# Altium schematic sheet SOW_2018_V1.SchDoc
size A1
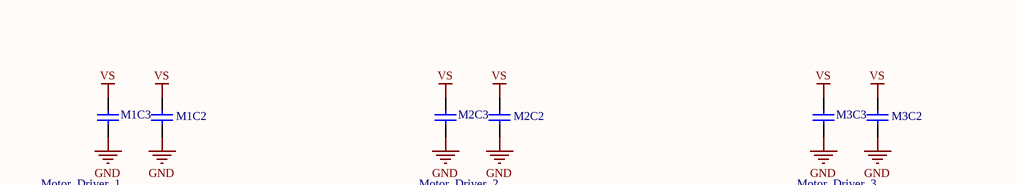
[diagram p0: SOW_2018_V1.SchDoc, top left]
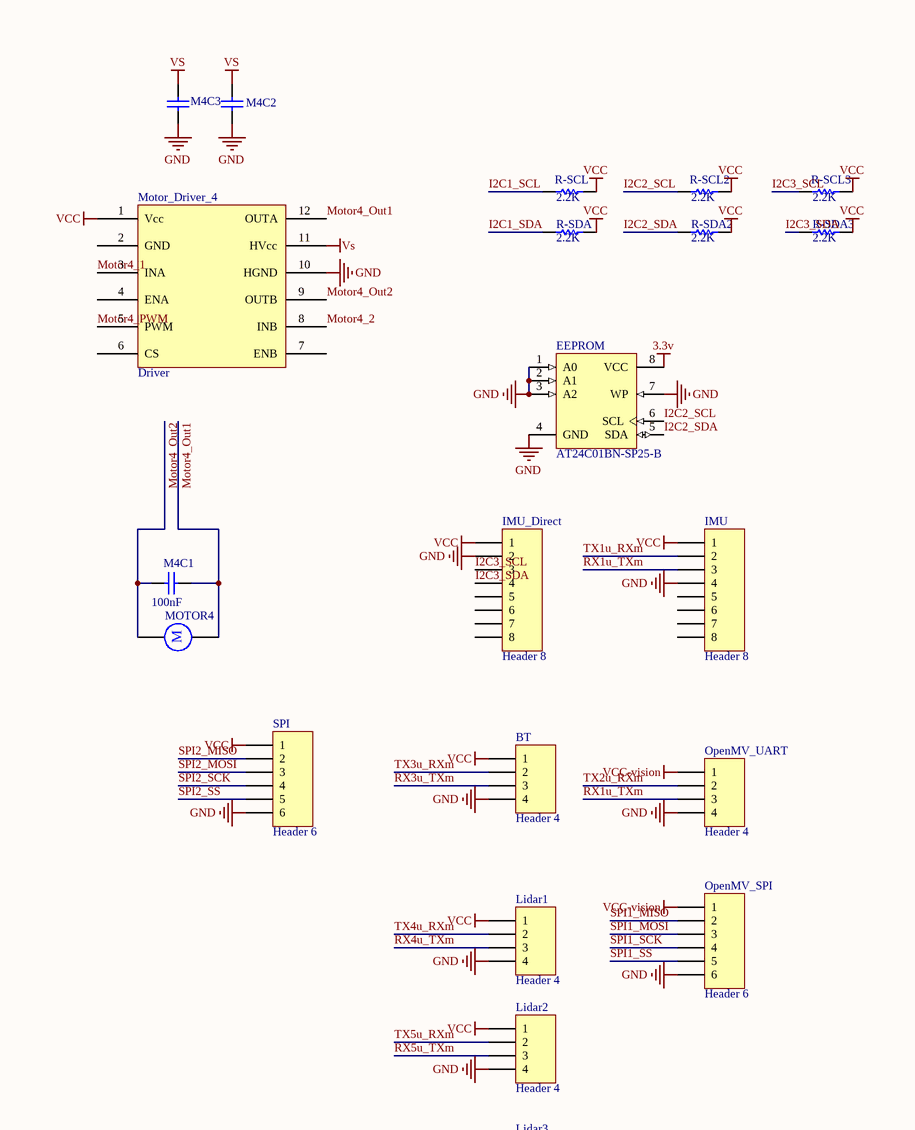
[diagram p1: SOW_2018_V1.SchDoc, top right]
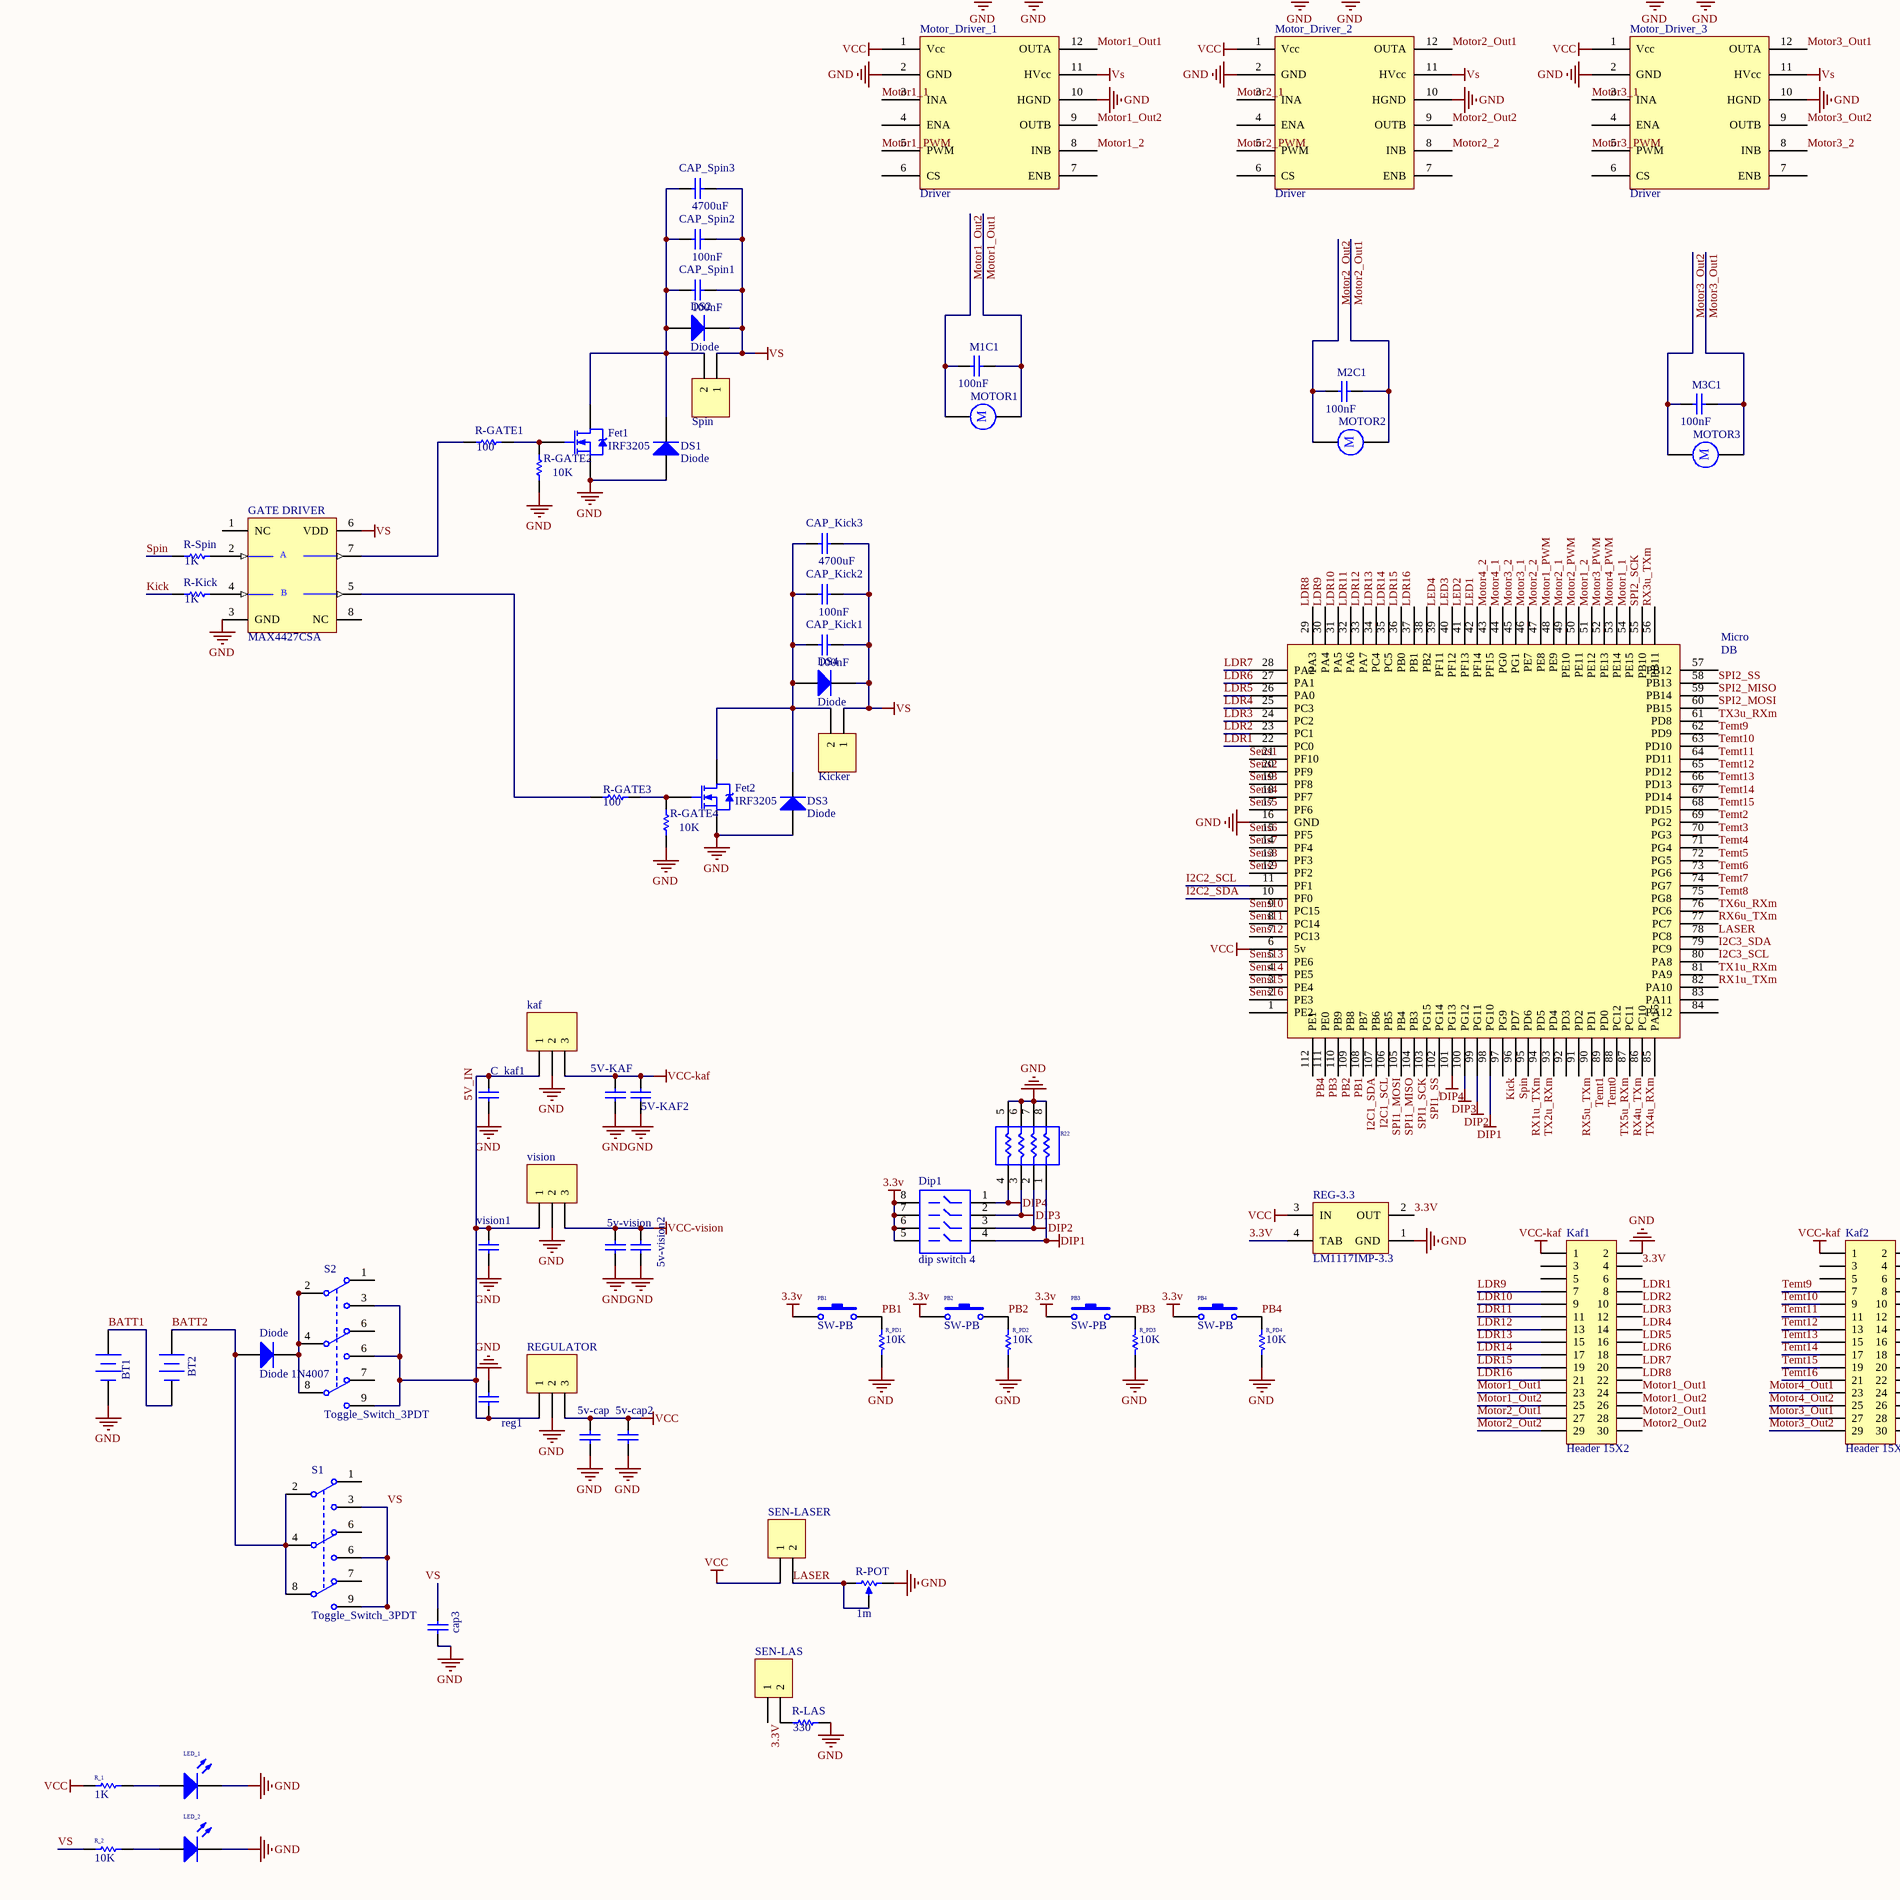
[diagram p2: SOW_2018_V1.SchDoc, bottom left]
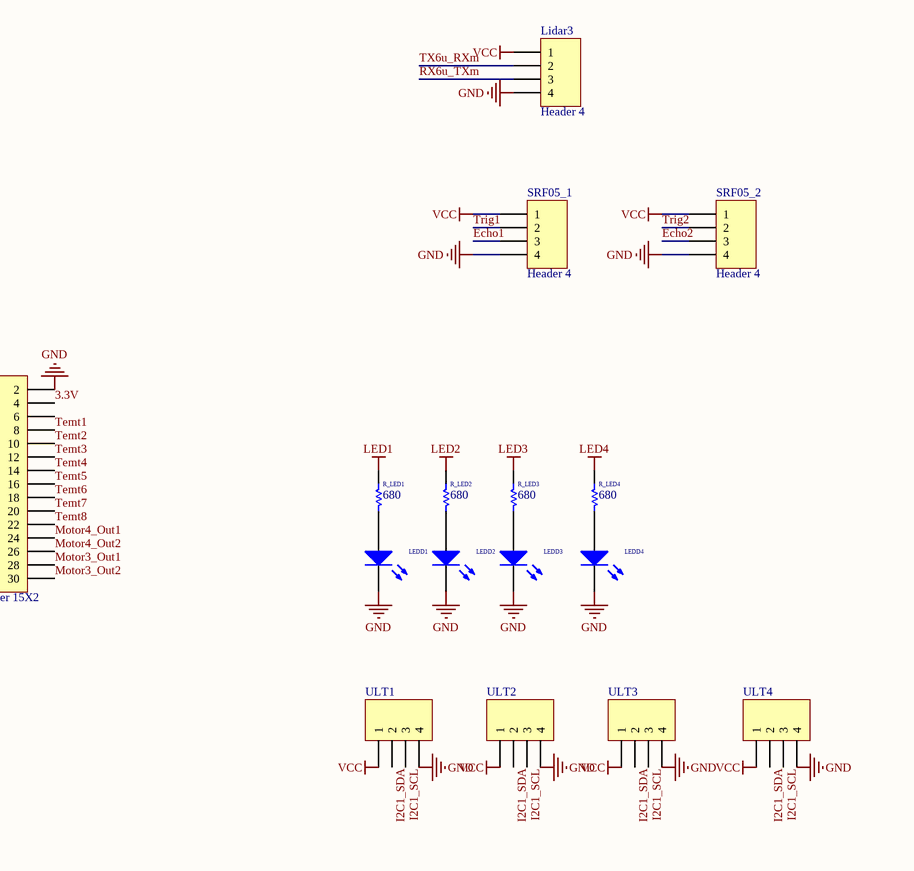
[diagram p3: SOW_2018_V1.SchDoc, bottom right]

## Parts
5v-cap  Cap  [c100_63v]  (value not drawn)
5v-cap2  Cap Semi  [805]  (value not drawn)
5V-KAF  Cap  [c100_63v]  (value not drawn)
5V-KAF2  Cap Semi  [805]  (value not drawn)
5v-vision  Cap  [c100_63v]  (value not drawn)
5v-vision2  Cap Semi  [805]  (value not drawn)
BT  Header 4  [Round4]
BT1  Battery  [XT60]  (value not drawn)
BT2  Battery  [XT60]  (value not drawn)
C_kaf1  Cap Semi  [805]  (value not drawn)
cap3  Cap  [C1000uf50v]  (value not drawn)
CAP_Kick1  100nf  [805]
CAP_Kick2  100nf  [805]
CAP_Kick3  4700uf  [805]
CAP_Spin1  100nf  [805]
CAP_Spin2  100nf  [805]
CAP_Spin3  4700uf  [805]
Diode  Diode 1N4007  [STTA806]
Dip1  dip switch 4  [DIPsw4]
DS1  Diode  [stta806]
DS2  Diode  [stta806]
DS3  Diode  [stta806]
DS4  Diode  [stta806]
EEPROM  AT24C01BN-SP25-B  [8S1_M]
Fet1  IRF3205  [TO220]
Fet2  IRF3205  [TO220]
GATE_DRIVER  MAX4427CSA  [SO-8]
IMU  Header 8  [Round8]
IMU_Direct  Header 8  [Round8]
kaf  Header 3  [LM2576]  (value not drawn)
Kaf1  Header 15X2  [PHL2X15]
Kaf2  Header 15X2  [PHL2X15]
Kicker  Header 2  [Phoenix_2pin]  (value not drawn)
LED_1  LED Green 0603  [805]  (value not drawn)
LED_2  LED Green 0805  [805]  (value not drawn)
LEDD1  LED Green 0603  [805]  (value not drawn)
LEDD2  LED Green 0603  [805]  (value not drawn)
LEDD3  LED Green 0603  [805]  (value not drawn)
LEDD4  LED Green 0603  [805]  (value not drawn)
Lidar1  Header 4  [Round4]
Lidar2  Header 4  [Round4]
Lidar3  Header 4  [Round4]
M1C1  value 100nF  [C0805]  (hidden comment: Cap Semi)
M1C2  Cap Semi  [C0805]  (value not drawn)
M1C3  Cap Semi  [C1000uf50v]  (value not drawn)
M2C1  value 100nF  [C0805]  (hidden comment: Cap Semi)
M2C2  Cap Semi  [C0805]  (value not drawn)
M2C3  Cap Semi  [C1000uf50v]  (value not drawn)
M3C1  value 100nF  [C0805]  (hidden comment: Cap Semi)
M3C2  Cap Semi  [C0805]  (value not drawn)
M3C3  Cap Semi  [C1000uf50v]  (value not drawn)
M4C1  value 100nF  [C0805]  (hidden comment: Cap Semi)
M4C2  Cap Semi  [C0805]  (value not drawn)
M4C3  Cap Semi  [C1000uf50v]  (value not drawn)
Micro  DB  [DBPCB]
MOTOR1  Motor  [Round2]  (value not drawn)
MOTOR2  Motor  [Round2]  (value not drawn)
MOTOR3  Motor  [Round2]  (value not drawn)
MOTOR4  Motor  [Round2]  (value not drawn)
Motor_Driver_1  Driver  [Driver]
Motor_Driver_2  Driver  [Driver]
Motor_Driver_3  Driver  [Driver]
Motor_Driver_4  Driver  [Driver]
OpenMV_SPI  Header 6  [Round6]
OpenMV_UART  Header 4  [Round4]
PB1  SW-PB  [TactSMD]
PB2  SW-PB  [TactSMD]
PB3  SW-PB  [TactSMD]
PB4  SW-PB  [TactSMD]
R22  10K  [Res_Array]  (value not drawn)
R-GATE1  100  [805]
R-GATE2  value 10K  [805]  (hidden comment: Res1)
R-GATE3  100  [805]
R-GATE4  value 10K  [805]  (hidden comment: Res1)
R-Kick  1K  [805]
R-LAS  value 330  [805]  (hidden comment: Res1)
R-POT  value 1m  [Multiturn]  (hidden comment: RPot)
R-SCL  value 2.2K  [805]  (hidden comment: Res1)
R-SCL2  value 2.2K  [805]  (hidden comment: Res1)
R-SCL3  value 2.2K  [805]  (hidden comment: Res1)
R-SDA  value 2.2K  [805]  (hidden comment: Res1)
R-SDA2  value 2.2K  [805]  (hidden comment: Res1)
R-SDA3  value 2.2K  [805]  (hidden comment: Res1)
R-Spin  1K  [805]
R_1  1K  [805]
R_2  10K  [805]
R_LED1  value 680  [805]  (hidden comment: 680 603)
R_LED2  value 680  [805]  (hidden comment: 680 603)
R_LED3  value 680  [805]  (hidden comment: 680 603)
R_LED4  value 680  [805]  (hidden comment: 680 603)
R_PD1  value 10K  [805]  (hidden comment: 10K 603)
R_PD2  value 10K  [805]  (hidden comment: 10K 603)
R_PD3  value 10K  [805]  (hidden comment: 10K 603)
R_PD4  value 10K  [805]  (hidden comment: 10K 603)
reg1  Cap  [805]  (value not drawn)
REG-3.3  LM1117IMP-3.3  [MP04A_N]
REGULATOR  Header 3  [LM2576]  (value not drawn)
S1  Toggle_Switch_3PDT  [TS_3dpt]
S2  Toggle_Switch_3PDT  [TS_3dpt]
SEN-LAS  Header 2  [Round2]  (value not drawn)
SEN-LASER  Header 2  [Round2]  (value not drawn)
SPI  Header 6  [Round6]
Spin  Header 2  [Phoenix_2pin]  (value not drawn)
SRF05_1  Header 4  [Round4]
SRF05_2  Header 4  [Round4]
ULT1  Header 4  [Round4]  (value not drawn)
ULT2  Header 4  [Round4]  (value not drawn)
ULT3  Header 4  [Round4]  (value not drawn)
ULT4  Header 4  [Round4]  (value not drawn)
vision  Header 3  [LM2576]  (value not drawn)
vision1  Cap Semi  [805]  (value not drawn)

## Nets
3.3V: Dip1.5 Dip1.6 Dip1.7 Dip1.8 EEPROM.8(VCC) Kaf1.4 Kaf2.4 PB1.2 PB2.2 PB3.2 PB4.2 REG-3.3.2(OUT) REG-3.3.4(TAB) SEN-LAS.1
DIP1: Dip1.4 Micro.98(PG10) R22.1
DIP2: Dip1.3 Micro.99(PG11) R22.2
DIP3: Dip1.2 Micro.100(PG12) R22.3
DIP4: Dip1.1 Micro.101(PG13) R22.4
GND: 5v-cap.1 5v-cap2.1 5V-KAF.1 5V-KAF2.1 5v-vision.1 5v-vision2.1 BT.4 BT1.2(-) C_kaf1.1 cap3.1 DS1.1(A) DS3.1(A) EEPROM.1(A0) EEPROM.2(A1) EEPROM.3(A2) EEPROM.4(GND) EEPROM.7(WP) Fet1.3(S) Fet2.3(S) GATE_DRIVER.3(GND) IMU.4 IMU_Direct.2 kaf.2 Kaf1.2 Kaf2.2 LED_1.2(K) LED_2.2(K) LEDD1.2(K) LEDD2.2(K) LEDD3.2(K) LEDD4.2(K) Lidar1.4 Lidar2.4 Lidar3.4 M1C2.1 M1C3.1 M2C2.1 M2C3.1 M3C2.1 M3C3.1 M4C2.1 M4C3.1 Micro.16(GND) Motor_Driver_1.2(GND) Motor_Driver_1.10(HGND) Motor_Driver_2.2(GND) Motor_Driver_2.10(HGND) Motor_Driver_3.2(GND) Motor_Driver_3.10(HGND) Motor_Driver_4.10(HGND) OpenMV_SPI.6 OpenMV_UART.4 R22.5 R22.6 R22.7 R22.8 R-GATE2.1 R-GATE4.1 R-LAS.2 R-POT.2(BOT) R_PD1.2 R_PD2.2 R_PD3.2 R_PD4.2 reg1.2 REG-3.3.1(GND) REGULATOR.2 SPI.6 SRF05_1.4 SRF05_2.4 ULT1.4 ULT2.4 ULT3.4 ULT4.4 vision.2 vision1.1
LED1: Micro.42(PF14) R_LED1.1
LED2: Micro.41(PF13) R_LED2.1
LED3: Micro.40(PF12) R_LED3.1
LED4: Micro.39(PF11) R_LED4.1
VCC: 5v-cap.2 5v-cap2.2 BT.1 IMU.1 IMU_Direct.1 Lidar1.1 Lidar2.1 Lidar3.1 Micro.6(5v) Motor_Driver_1.1(Vcc) Motor_Driver_2.1(Vcc) Motor_Driver_3.1(Vcc) Motor_Driver_4.1(Vcc) R-SCL.2 R-SCL2.2 R-SCL3.2 R-SDA.2 R-SDA2.2 R-SDA3.2 R_1.2 REG-3.3.3(IN) REGULATOR.3 SEN-LASER.1 SPI.1 SRF05_1.1 SRF05_2.1 ULT1.1 ULT2.1 ULT3.1 ULT4.1
VCC-kaf: 5V-KAF.2 5V-KAF2.2 kaf.3 Kaf1.1 Kaf2.1
VCC-vision: 5v-vision.2 5v-vision2.2 OpenMV_SPI.1 OpenMV_UART.1 vision.3
VS: CAP_Kick1.2 CAP_Kick2.2 CAP_Kick3.2 CAP_Spin1.2 CAP_Spin2.2 CAP_Spin3.2 DS2.2(K) DS4.2(K) GATE_DRIVER.6(VDD) Kicker.1 M1C2.2 M1C3.2 M2C2.2 M2C3.2 M3C2.2 M3C3.2 M4C2.2 M4C3.2 Motor_Driver_1.11(HVcc) Motor_Driver_2.11(HVcc) Motor_Driver_3.11(HVcc) Motor_Driver_4.11(HVcc) R_2.2 S1.3(NO1) S1.6(NC2) S1.9(NO2) Spin.1
5V_IN: C_kaf1.2 kaf.1 reg1.1 REGULATOR.1 S2.3(NO1) S2.6(NC2) S2.9(NO2) vision.1 vision1.2
BATT1: BT1.1(+) BT2.2(-)
BATT2: BT2.1(+) Diode.1(A) S1.2(COMMON1) S1.4(COMMON2) S1.8(COMMON2)
Echo1: SRF05_1.3
Echo2: SRF05_2.3
I2C1_SCL: Micro.107(PB6) R-SCL.1 ULT1.3 ULT2.3 ULT3.3 ULT4.3
I2C1_SDA: Micro.108(PB7) R-SDA.1 ULT1.2 ULT2.2 ULT3.2 ULT4.2
I2C2_SCL: EEPROM.6(SCL) Micro.11(PF1) R-SCL2.1
I2C2_SDA: EEPROM.5(SDA) Micro.10(PF0) R-SDA2.1
I2C3_SCL: IMU_Direct.3 Micro.80(PA8) R-SCL3.1
I2C3_SDA: IMU_Direct.4 Micro.79(PC9) R-SDA3.1
Kick: Micro.97(PG9) R-Kick.1
LASER: Micro.78(PC8) R-POT.1(TOP) R-POT.3(TAP) SEN-LASER.2
LDR1: Kaf1.8 Micro.22(PC0)
LDR2: Kaf1.10 Micro.23(PC1)
LDR3: Kaf1.12 Micro.24(PC2)
LDR4: Kaf1.14 Micro.25(PC3)
LDR5: Kaf1.16 Micro.26(PA0)
LDR6: Kaf1.18 Micro.27(PA1)
LDR7: Kaf1.20 Micro.28(PA2)
LDR8: Kaf1.22 Micro.29(PA3)
LDR9: Kaf1.7 Micro.30(PA4)
LDR10: Kaf1.9 Micro.31(PA5)
LDR11: Kaf1.11 Micro.32(PA6)
LDR12: Kaf1.13 Micro.33(PA7)
LDR13: Kaf1.15 Micro.34(PC4)
LDR14: Kaf1.17 Micro.35(PC5)
LDR15: Kaf1.19 Micro.36(PB0)
LDR16: Kaf1.21 Micro.37(PB1)
Motor1_1: Micro.54(PE15) Motor_Driver_1.3(INA)
Motor1_2: Micro.51(PE12) Motor_Driver_1.8(INB)
Motor1_Out1: Kaf1.23 Kaf1.24 M1C1.2 MOTOR1.2 Motor_Driver_1.12(OUTA)
Motor1_Out2: Kaf1.25 Kaf1.26 M1C1.1 MOTOR1.1 Motor_Driver_1.9(OUTB)
Motor1_PWM: Micro.48(PE9) Motor_Driver_1.5(PWM)
Motor2_1: Micro.49(PE10) Motor_Driver_2.3(INA)
Motor2_2: Micro.47(PE8) Motor_Driver_2.8(INB)
Motor2_Out1: Kaf1.27 Kaf1.28 M2C1.2 MOTOR2.2 Motor_Driver_2.12(OUTA)
Motor2_Out2: Kaf1.29 Kaf1.30 M2C1.1 MOTOR2.1 Motor_Driver_2.9(OUTB)
Motor2_PWM: Micro.50(PE11) Motor_Driver_2.5(PWM)
Motor3_1: Micro.46(PE7) Motor_Driver_3.3(INA)
Motor3_2: Micro.45(PG1) Motor_Driver_3.8(INB)
Motor3_Out1: Kaf2.27 Kaf2.28 M3C1.2 MOTOR3.2 Motor_Driver_3.12(OUTA)
Motor3_Out2: Kaf2.29 Kaf2.30 M3C1.1 MOTOR3.1 Motor_Driver_3.9(OUTB)
Motor3_PWM: Micro.52(PE13) Motor_Driver_3.5(PWM)
Motor4_1: Micro.44(PG0) Motor_Driver_4.3(INA)
Motor4_2: Micro.43(PF15) Motor_Driver_4.8(INB)
Motor4_Out1: Kaf2.23 Kaf2.24 M4C1.2 MOTOR4.2 Motor_Driver_4.12(OUTA)
Motor4_Out2: Kaf2.25 Kaf2.26 M4C1.1 MOTOR4.1 Motor_Driver_4.9(OUTB)
Motor4_PWM: Micro.53(PE14) Motor_Driver_4.5(PWM)
PB1: Micro.109(PB8) PB1.1 R_PD1.1
PB2: Micro.110(PB9) PB2.1 R_PD2.1
PB3: Micro.111(PE0) PB3.1 R_PD3.1
PB4: Micro.112(PE1) PB4.1 R_PD4.1
RX1u_TXm: IMU.3 Micro.82(PA10) Micro.95(PD6) OpenMV_UART.3
RX3u_TXm: BT.3 Micro.56(PB11)
RX4u_TXm: Lidar1.3 Micro.87(PC11)
RX5u_TXm: Lidar2.3 Micro.91(PD2)
RX6u_TXm: Lidar3.3 Micro.77(PC7)
Sens1: Micro.21(PF10)
Sens2: Micro.20(PF9)
Sens3: Micro.19(PF8)
Sens4: Micro.18(PF7)
Sens5: Micro.17(PF6)
Sens6: Micro.15(PF5)
Sens7: Micro.14(PF4)
Sens8: Micro.13(PF3)
Sens9: Micro.12(PF2)
Sens10: Micro.9(PC15)
Sens11: Micro.8(PC14)
Sens12: Micro.7(PC13)
Sens13: Micro.5(PE6)
Sens14: Micro.4(PE5)
Sens15: Micro.3(PE4)
Sens16: Micro.2(PE3)
SPI1_MISO: Micro.105(PB4) OpenMV_SPI.2
SPI1_MOSI: Micro.106(PB5) OpenMV_SPI.3
SPI1_SCK: Micro.104(PB3) OpenMV_SPI.4
SPI1_SS: Micro.103(PG15) OpenMV_SPI.5
SPI2_MISO: Micro.59(PB14) SPI.2
SPI2_MOSI: Micro.60(PB15) SPI.3
SPI2_SCK: Micro.55(PB10) SPI.4
SPI2_SS: Micro.58(PB13) SPI.5
Spin: Micro.96(PD7) R-Spin.1
Temt0: Micro.89(PD0)
Temt1: Kaf2.8 Micro.90(PD1)
Temt2: Kaf2.10 Micro.69(PG2)
Temt3: Kaf2.12 Micro.70(PG3)
Temt4: Kaf2.14 Micro.71(PG4)
Temt5: Kaf2.16 Micro.72(PG5)
Temt6: Kaf2.18 Micro.73(PG6)
Temt7: Kaf2.20 Micro.74(PG7)
Temt8: Kaf2.22 Micro.75(PG8)
Temt9: Kaf2.7 Micro.62(PD9)
Temt10: Kaf2.9 Micro.63(PD10)
Temt11: Kaf2.11 Micro.64(PD11)
Temt12: Kaf2.13 Micro.65(PD12)
Temt13: Kaf2.15 Micro.66(PD13)
Temt14: Kaf2.17 Micro.67(PD14)
Temt15: Kaf2.19 Micro.68(PD15)
Temt16: Kaf2.21
Trig1: SRF05_1.2
Trig2: SRF05_2.2
TX1u_RXm: IMU.2 Micro.81(PA9)
TX2u_RXm: Micro.94(PD5) OpenMV_UART.2
TX3u_RXm: BT.2 Micro.61(PD8)
TX4u_RXm: Lidar1.2 Micro.86(PC10)
TX5u_RXm: Lidar2.2 Micro.88(PC12)
TX6u_RXm: Lidar3.2 Micro.76(PC6)
NetCAP_Kick1_1: CAP_Kick1.1 CAP_Kick2.1 CAP_Kick3.1 DS3.2(K) DS4.1(A) Fet2.2(D) Kicker.2
NetCAP_Spin1_1: CAP_Spin1.1 CAP_Spin2.1 CAP_Spin3.1 DS1.2(K) DS2.1(A) Fet1.2(D) Spin.2
NetDiode_2: Diode.2(K) S2.2(COMMON1) S2.4(COMMON2) S2.8(COMMON2)
NetFet1_1: Fet1.1(G) R-GATE1.2 R-GATE2.2
NetFet2_1: Fet2.1(G) R-GATE3.2 R-GATE4.2
NetGATE_DRIVER_2: GATE_DRIVER.2(INA) R-Spin.2
NetGATE_DRIVER_4: GATE_DRIVER.4(INB) R-Kick.2
NetGATE_DRIVER_5: GATE_DRIVER.5(OUTB) R-GATE3.1
NetGATE_DRIVER_7: GATE_DRIVER.7(OUTA) R-GATE1.1
NetLED_1_1: LED_1.1(A) R_1.1
NetLED_2_1: LED_2.1(A) R_2.1
NetLEDD1_1: LEDD1.1(A) R_LED1.2
NetLEDD2_1: LEDD2.1(A) R_LED2.2
NetLEDD3_1: LEDD3.1(A) R_LED3.2
NetLEDD4_1: LEDD4.1(A) R_LED4.2
NetR-LAS_1: R-LAS.1 SEN-LAS.2

Not connected (* = marked no-connect by the designer): cap3 2; GATE_DRIVER 1(NC) 8(NC); IMU 5 6 7 8; IMU_Direct 5 6 7 8; Kaf1 3 5 6; Kaf2 3 5 6; Micro 1(PE2) 38(PB2) 57(PB12) 83(PA11) 84(PA12) 85(PA15) 92(PD3) 93(PD4) 102(PG14); Motor_Driver_1 4(ENA) 6(CS) 7(ENB); Motor_Driver_2 4(ENA) 6(CS) 7(ENB); Motor_Driver_3 4(ENA) 6(CS) 7(ENB); Motor_Driver_4 2(GND) 4(ENA) 6(CS) 7(ENB); S1 1(NC1) 7(NC2); S2 1(NC1) 7(NC2)

## Notes on the sheet
- Labels drawn without touching a wire or pin: VS
- (in symbol MAX4427CSA) A; B
- (in symbol Motor) M

## Library data of the parts
5v-cap 5V-KAF 5v-vision cap3 reg1 = Cap: Capacitor; Value: 6800uf; Published: 8-Jun-2000; LatestRevisionDate: 17-Jul-2002; LatestRevisionNote: Re-released for DXP Platform.; PackageReference: RAD-0.3; Publisher: Altium Limited
5v-cap2 5V-KAF2 5v-vision2 C_kaf1 M1C2 M1C3 M2C2 M2C3 M3C2 M3C3 M4C2 M4C3 vision1 = Cap Semi: Capacitor (Semiconductor SIM Model); Value: 100nF; Published: 8-Jun-2000; LatestRevisionDate: 17-Jul-2002; LatestRevisionNote: Re-released for DXP Platform.; PackageReference: C1206; Publisher: Altium Limited
BT Lidar1-Lidar3 OpenMV_UART SRF05_1 SRF05_2 ULT1-ULT4 = Header 4: Header, 4-Pin; LatestRevisionDate: 17-Jul-2002; LatestRevisionNote: Re-released for DXP Platform.; Publisher: Altium Limited
BT1 BT2 = Battery: Multicell Battery; Published: 24-Mar-1999; LatestRevisionDate: 17-Jul-2002; LatestRevisionNote: Re-released for DXP Platform.; PackageReference: BAT-2; Publisher: Altium Limited
CAP_Kick1-CAP_Kick3 CAP_Spin1-CAP_Spin3 = Cap: Capacitor; Published: 8-Jun-2000; LatestRevisionDate: 17-Jul-2002; LatestRevisionNote: Re-released for DXP Platform.; PackageReference: RAD-0.3; Publisher: Altium Limited
  CAP_Kick1 CAP_Kick2 CAP_Spin1 CAP_Spin2: Value: 100nF
  CAP_Kick3 CAP_Spin3: Value: 4700uF
Diode = Diode 1N4007: 1 Amp General Purpose Rectifier; Published: 8-Jun-2000; LatestRevisionDate: 17-Jul-2002; LatestRevisionNote: Re-released for DXP Platform.; DatasheetDocument: 1998; PackageDocument: Aug-1999; PackageReference: DO-41; Publisher: Altium Limited; Code_JEDEC: DO-204-AL; ComponentLink1Description: Manufacturer Link; ComponentLink1URL: http://www.fairchildsemi.com/; ComponentLink2Description: Datasheet; ComponentLink2URL: http://www.fairchildsemi.com/ds/1N%2F1N4001.pdf
Dip1 = SW-DIP4: DIP Switch; Published: 24-Mar-1999; LatestRevisionDate: 17-Jul-2002; LatestRevisionNote: Re-released for DXP Platform.; PackageReference: DIP-8; Publisher: Altium Limited
DS1-DS4 = Diode: Default Diode; Published: 8-Jun-2000; LatestRevisionDate: 17-Jul-2002; LatestRevisionNote: Re-released for DXP Platform.; PackageVersion: Sep-1996; PackageReference: SMC; Publisher: Altium Limited; PackageDescription: DO-214-AB/SMC; 2 C-Bend Leads; Body 7.9 x 5.9 mm, inc. leads (LxW); Code_JEDEC: DO-214-AB
EEPROM = AT24C01BN-SP25-B: 1Kbit (128 x 8), 2-wire Bus Automotive Serial EEPROM with Write Protect, 2.5V, 8-Pin SOIC, Bulk; DatasheetVersion: 8517C,  Jan-2009; PackageVersion: revC, Mar-2005; PackageReference: 8S1; PackageDescription: 8-Lead (0.150" Wide Body), Plastic Gull Wing Small Outline (JEDEC SOIC); Code_JEDEC: MS-012-AA; Code_IPC: SOIC127P600-8; ComponentLink1Description: Manufacturer URL; ComponentLink1URL: http://www.atmel.com/; ComponentLink2Description: Datasheet; ComponentLink2URL: http://www.atmel.com/dyn/resources/prod_documents/doc8517.pdf
Fet1 Fet2 = IRF3205: HEXFET Power MOSFET; Note: Pin 2 is electrically connected to pin 4.; Published: 8-Jun-2000; LatestRevisionDate: 17-Jul-2002; LatestRevisionNote: Re-released for DXP Platform.; DatasheetVersion: Aug-1997; PackageVersion: Feb-1997; PackageReference: TO-220AB; Publisher: Altium Limited; PackageDescription: TO, Thru-Hole, Vertical, Heatsink Mounted; 3 In-Line Leads; Pitch 2.54 mm; ComponentLink1Description: Manufacturer Link; ComponentLink1URL: http://www.irf.com/; ComponentLink2Description: Datasheet; ComponentLink2URL: http://www.irf.com/product-info/datasheets/data/irf3205.pdf
GATE_DRIVER = MAX4427CSA: Dual High-Speed 1.5A MOSFET Driver; Published: 16-Jan-2001; LatestRevisionDate: 13-Apr-2006; LatestRevisionNote: IPC-7351 Footprint Added.; DatasheetVersion: Mar-1993; PackageReference: NSO8; Publisher: Altium Limited; PackageDescription: 8-Pin Small Outline Integrated Circuit 1.27 mm Pitch; Code_JEDEC: MS-012-AA; Code_IPC: SOIC127P600-8; ComponentLink1Description: Manufacturer Link; ComponentLink1URL: http://www.maxim-ic.com/; ComponentLink2Description: Datasheet; ComponentLink2URL: http://pdfserv.maxim-ic.com/en/ds/MAX4426-MAX4428.pdf
IMU IMU_Direct = Header 8: Header, 8-Pin; LatestRevisionDate: 17-Jul-2002; LatestRevisionNote: Re-released for DXP Platform.; Publisher: Altium Limited
kaf REGULATOR vision = Header 3: Header, 3-Pin; LatestRevisionDate: 17-Jul-2002; LatestRevisionNote: Re-released for DXP Platform.; Publisher: Altium Limited
Kaf1 Kaf2 = Header 15X2: Header, 15-Pin, Dual row; LatestRevisionDate: 17-Jul-2002; LatestRevisionNote: Re-released for DXP Platform.; Publisher: Altium Limited
Kicker SEN-LAS SEN-LASER Spin = Header 2: Header, 2-Pin; LatestRevisionDate: 17-Jul-2002; LatestRevisionNote: Re-released for DXP Platform.; Publisher: Altium Limited
LED_1 LED_2 LEDD1-LEDD4 = LED0: Typical INFRARED GaAs LED; Published: 8-Jun-2000; Revision: July-2002: Re-released for DXP Platform.; Publisher: Altium Limited
M1C1 M2C1 M3C1 M4C1 = Cap Semi: Capacitor (Semiconductor SIM Model); Published: 8-Jun-2000; LatestRevisionDate: 17-Jul-2002; LatestRevisionNote: Re-released for DXP Platform.; PackageReference: C1206; Publisher: Altium Limited
MOTOR1-MOTOR4 = Motor: Motor, General Kind; Published: 24-Mar-1999; LatestRevisionDate: 17-Jul-2002; LatestRevisionNote: Re-released for DXP Platform.; PackageReference: RB5-10.5; Publisher: Altium Limited
OpenMV_SPI SPI = Header 6: Header, 6-Pin; LatestRevisionDate: 17-Jul-2002; LatestRevisionNote: Re-released for DXP Platform.; Publisher: Altium Limited
PB1-PB4 = SW-PB: Switch; Published: 24-Mar-1999; Revision: July-2002: Re-released for DXP Platform.; Publisher: Altium Limited
R22 = Res Array 4
R-GATE1-R-GATE4 R-Kick R-LAS R-SCL R-SCL2 R-SCL3 R-SDA R-SDA2 R-SDA3 R-Spin = Res1: Resistor; Published: 8-Jun-2000; LatestRevisionDate: 17-Jul-2002; LatestRevisionNote: Re-released for DXP Platform.; PackageReference: AXIAL-0.3; Publisher: Altium Limited
  R-GATE1 R-GATE3: Value: 100
  R-Kick R-Spin: Value: 1K
R-POT = RPot: Potentiometer; Sim Note: Enter the Resistance value and the set point into parameter fields.; Set Position: 0.5; Published: 8-Jun-2000; LatestRevisionDate: 17-Jul-2002; LatestRevisionNote: Re-released for DXP Platform.; PackageReference: VR5; Publisher: Altium Limited
R_1 R_2 R_LED1-R_LED4 R_PD1-R_PD4 = res1: Resistor; Published: 8-Jun-2000; LatestRevisionDate: 17-Jul-2002; LatestRevisionNote: Re-released for DXP Platform.; PackageReference: AXIAL-0.3; Publisher: Altium Limited
  R_1: Value: 1K
  R_2: Value: 10K
REG-3.3 = LM1117IMP-3.3: 800mA Low-Dropout Linear Regulator, 4-pin SOT-223; Manufacturer: National Semiconductor; PackageTopMarking: XYTT*N05B; PowerWise: N; CompType: LDO IC; High-Reliability: Y; DatasheetVersion: Apr-2006; PackageVersion: revB, Apr-2003; PackageReference: MP04A; PackageDescription: Molded SOT-223, 6.50 x 3.56 x 1.6mm Body, 4 Lead, 2.3mm Pitch; PartNumber: LM1117IMP-3.3; RoHS: N; PinCount: 4; Code_JEDEC: TO-261-AA; Code_IPC: SOT223-4; ComponentLink1Description: Manufacturer URL; ComponentLink1URL: http://www.national.com/; ComponentLink2Description: LM1117 Datasheet; ComponentLink2URL: http://www.national.com/ds/LM/LM1117.pdf; ComponentLink3Description: LM1117 Web Page; ComponentLink3URL: http://www.national.com/pf/LM/LM1117.html; ComponentLink4Description: MP04A Package Page; ComponentLink4URL: http://www.national.com/packaging/folders/mp04a.html